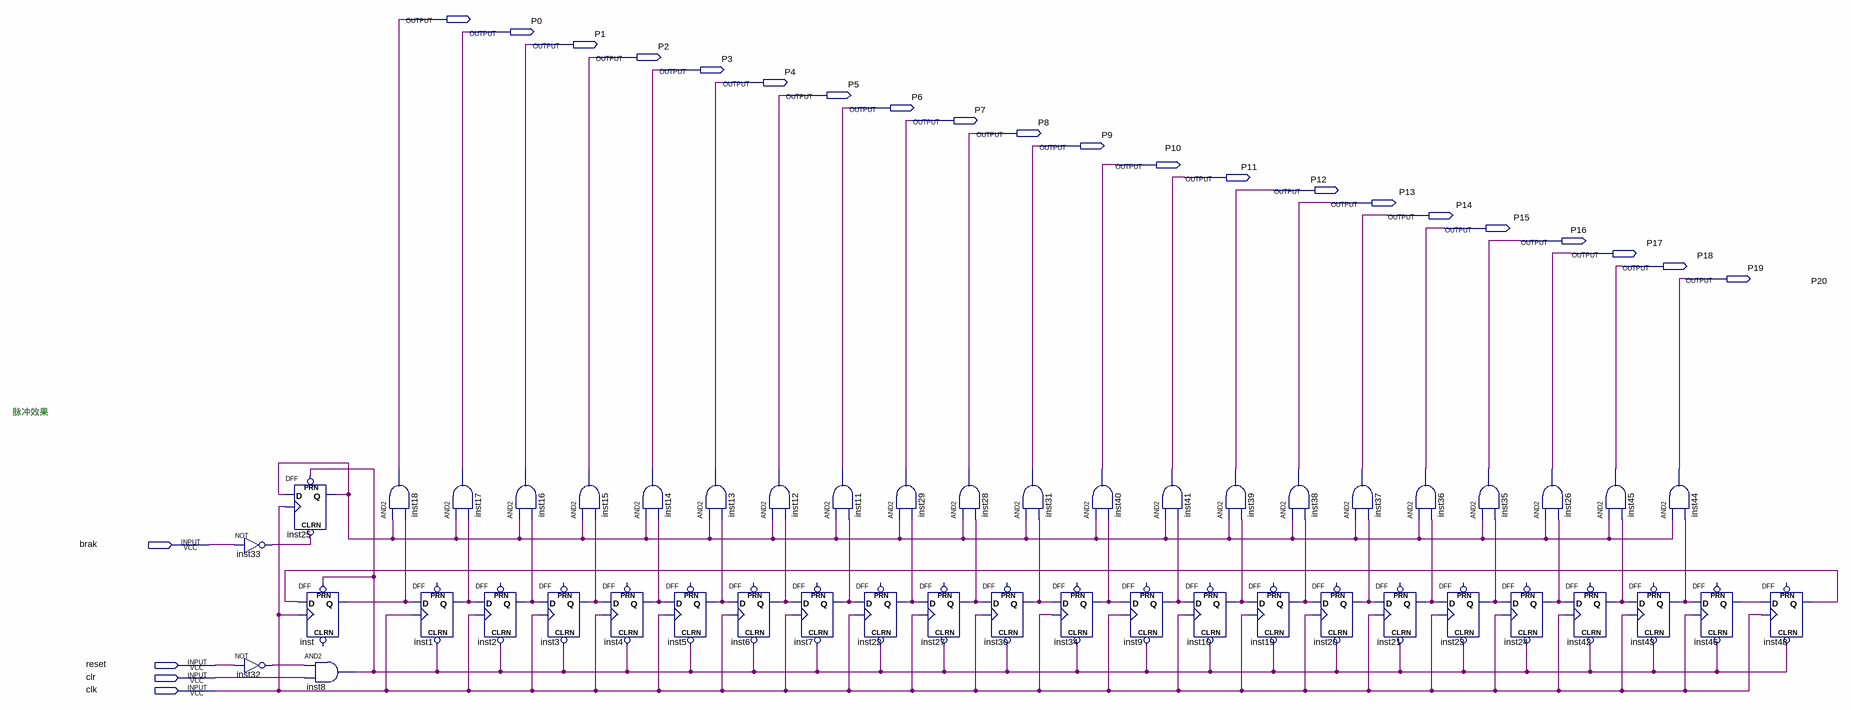
[diagram p0: schematic sheet]
// Quartus schematic JPQ.bdf as structural Verilog: 48 symbols, 25 pins
module JPQ (
  input  brak,
  input  reset,
  input  clr,
  input  clk,
  output P0,
  output P1,
  output P2,
  output P3,
  output P4,
  output P5,
  output P6,
  output P7,
  output P8,
  output P9,
  output P10,
  output P11,
  output P12,
  output P13,
  output P14,
  output P15,
  output P16,
  output P17,
  output P18,
  output P19,
  output P20
);

  wire inst1_q, inst2_q, inst3_q, inst4_q, inst5_q, inst6_q, inst7_q, inst8_out, inst9_q, inst10_q, inst19_q,
       inst20_q, inst21_q, inst22_q, inst23_q, inst24_q, inst25_q, inst27_q, inst30_q, inst32_out,
       inst33_out, inst34_q, inst42_q, inst43_q, inst46_q, inst48_q, inst_q;

  not inst33 (inst33_out, brak);
  not inst32 (inst32_out, reset);
  DFF inst25 (.CLRN(inst33_out), .CLK(clk), .D(inst25_q), .PRN(inst8_out), .Q(inst25_q));
  DFF inst (.CLK(clk), .D(inst48_q), .PRN(inst8_out), .Q(inst_q));  // open: CLRN
  and inst8 (inst8_out, inst32_out, clr);
  and inst18 (P0, inst25_q, inst_q);
  DFF inst1 (.CLRN(inst8_out), .CLK(clk), .D(inst_q), .Q(inst1_q));  // open: PRN
  and inst17 (P1, inst25_q, inst1_q);
  DFF inst2 (.CLRN(inst8_out), .CLK(clk), .D(inst1_q), .Q(inst2_q));  // open: PRN
  and inst16 (P2, inst25_q, inst2_q);
  DFF inst3 (.CLRN(inst8_out), .CLK(clk), .D(inst2_q), .Q(inst3_q));  // open: PRN
  and inst15 (P3, inst25_q, inst3_q);
  and inst14 (P4, inst25_q, inst4_q);
  DFF inst4 (.CLRN(inst8_out), .CLK(clk), .D(inst3_q), .Q(inst4_q));  // open: PRN
  DFF inst5 (.CLRN(inst8_out), .CLK(clk), .D(inst4_q), .Q(inst5_q));  // open: PRN
  and inst13 (P5, inst25_q, inst5_q);
  DFF inst6 (.CLRN(inst8_out), .CLK(clk), .D(inst5_q), .Q(inst6_q));  // open: PRN
  and inst12 (P6, inst25_q, inst6_q);
  DFF inst7 (.CLRN(inst8_out), .CLK(clk), .D(inst6_q), .Q(inst7_q));  // open: PRN
  and inst11 (P7, inst25_q, inst7_q);
  and inst29 (P8, inst25_q, inst22_q);
  DFF inst22 (.CLRN(inst8_out), .CLK(clk), .D(inst7_q), .Q(inst22_q));  // open: PRN
  DFF inst27 (.CLRN(inst8_out), .CLK(clk), .D(inst22_q), .Q(inst27_q));  // open: PRN
  and inst28 (P9, inst25_q, inst27_q);
  DFF inst30 (.CLRN(inst8_out), .CLK(clk), .D(inst27_q), .Q(inst30_q));  // open: PRN
  and inst31 (P10, inst25_q, inst30_q);
  and inst40 (P11, inst25_q, inst34_q);
  DFF inst34 (.CLRN(inst8_out), .CLK(clk), .D(inst30_q), .Q(inst34_q));  // open: PRN
  DFF inst9 (.CLRN(inst8_out), .CLK(clk), .D(inst34_q), .Q(inst9_q));  // open: PRN
  and inst41 (P12, inst25_q, inst9_q);
  DFF inst10 (.CLRN(inst8_out), .CLK(clk), .D(inst9_q), .Q(inst10_q));  // open: PRN
  and inst39 (P13, inst25_q, inst10_q);
  DFF inst19 (.CLRN(inst8_out), .CLK(clk), .D(inst10_q), .Q(inst19_q));  // open: PRN
  and inst38 (P14, inst25_q, inst19_q);
  and inst37 (P15, inst25_q, inst20_q);
  DFF inst20 (.CLRN(inst8_out), .CLK(clk), .D(inst19_q), .Q(inst20_q));  // open: PRN
  DFF inst21 (.CLRN(inst8_out), .CLK(clk), .D(inst20_q), .Q(inst21_q));  // open: PRN
  and inst36 (P16, inst25_q, inst21_q);
  DFF inst23 (.CLRN(inst8_out), .CLK(clk), .D(inst21_q), .Q(inst23_q));  // open: PRN
  and inst35 (P17, inst25_q, inst23_q);
  DFF inst24 (.CLRN(inst8_out), .CLK(clk), .D(inst23_q), .Q(inst24_q));  // open: PRN
  and inst26 (P18, inst25_q, inst24_q);
  and inst45 (P19, inst25_q, inst42_q);
  DFF inst42 (.CLRN(inst8_out), .CLK(clk), .D(inst24_q), .Q(inst42_q));  // open: PRN
  DFF inst43 (.CLRN(inst8_out), .CLK(clk), .D(inst42_q), .Q(inst43_q));  // open: PRN
  and inst44 (P20, inst25_q, inst43_q);
  DFF inst46 (.CLRN(inst8_out), .CLK(clk), .D(inst43_q), .Q(inst46_q));  // open: PRN
  DFF inst48 (.CLRN(inst8_out), .CLK(clk), .D(inst46_q), .Q(inst48_q));  // open: PRN

  // Notes on the sheet:
  //   脉冲效果
endmodule
